# Altium schematic sheet Modem-GPRS.SchDoc
size Letter; ApprovedBy: M. en C. Fernando Bolaños; CheckedBy: M. en C. José Alberto Balderas Castillo (CID); Author: M. en C. José Alberto Balderas Castillo (CID); Revision: v1; NombreTarjeta: TELCOMGPRS-v1; NumeroDeHoja: 5 de 7; NombreBloque: Puertos Seriales RS232 Externos; FechaDiseno: 02-Junio-2015; FechaRevision: 05-Junio-2015; FechaAprobacion: 16-Junio-2015; TamanoHoja: Carta; NombreProyecto: Telemetria GPRS de Bajo Consumo de Energia
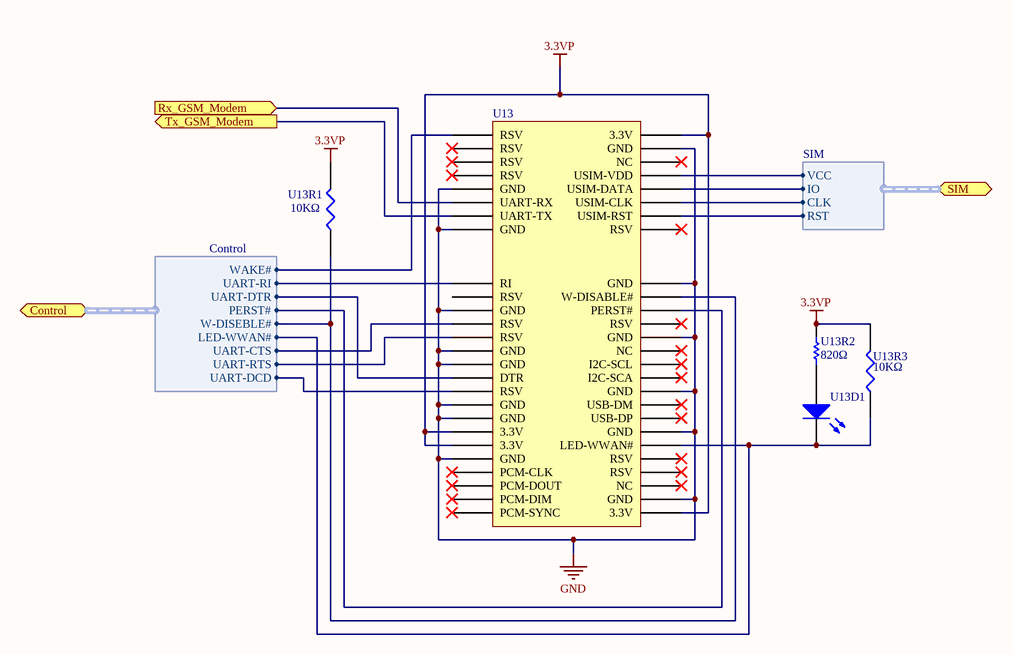
[diagram p0: Modem-GPRS.SchDoc]

## Parts
U13  MiniPCIe  [MiniPCI-52]  (value not drawn)
U13D1  LED2  [0805-LEDG]  (value not drawn)
U13R1  10KΩ  [0805-RES]
U13R2  820Ω  [0805-RES]
U13R3  10KΩ  [0805-RES]

## Ports
Control (harness Control), Rx_GSM_Modem (in), SIM (harness SIM), Tx_GSM_Modem (out)

## Harnesses
Control: UART-RI, UART-DTR, PERST#, W-DISEBLE#, LED-WWAN#, UART-CTS, UART-RTS, UART-DCD, WAKE#
SIM: VCC, IO, CLK, RST

## Nets
3.3VP: U13.2(3.3V) U13.39(3.3V) U13.41(3.3V) U13.52(3.3V) U13R1.2 U13R2.2 U13R3.2
GND: U13.4(GND) U13.9(GND) U13.15(GND) U13.18(GND) U13.21(GND) U13.26(GND) U13.27(GND) U13.29(GND) U13.34(GND) U13.35(GND) U13.37(GND) U13.40(GND) U13.43(GND) U13.50(GND)
Rx_GSM_Modem: U13.11(UART-RX) ; port Rx_GSM_Modem
Tx_GSM_Modem: U13.13(UART-TX) ; port Tx_GSM_Modem
NetU13_1: U13.1(RSV) ; port Control.WAKE#
NetU13_8: U13.8(USIM-VDD) ; port SIM.VCC
NetU13_10: U13.10(USIM-DATA) ; port SIM.IO
NetU13_12: U13.12(USIM-CLK) ; port SIM.CLK
NetU13_14: U13.14(USIM-RST) ; port SIM.RST
NetU13_17: U13.17(RI) ; port Control.UART-RI
NetU13_20: U13.20(W-DISABLE#) U13R1.1 ; port Control.W-DISEBLE#
NetU13_22: U13.22(PERST#) ; port Control.PERST#
NetU13_23: U13.23(RSV) ; port Control.UART-CTS
NetU13_25: U13.25(RSV) ; port Control.UART-RTS
NetU13_31: U13.31(DTR) ; port Control.UART-DTR
NetU13_33: U13.33(RSV) ; port Control.UART-DCD
NetU13_42: U13.42(LED-WWAN#) U13D1.2(K) U13R3.1 ; port Control.LED-WWAN#
NetU13D1_1: U13D1.1(A) U13R2.1

Not connected (* = marked no-connect by the designer): U13 3(RSV)* 5(RSV)* 6(NC)* 7(RSV)* 16(RSV)* 19(RSV) 24(RSV)* 28(NC)* 30(I2C-SCL)* 32(I2C-SCA)* 36(USB-DM)* 38(USB-DP)* 44(RSV)* 45(PCM-CLK)* 46(RSV)* 47(PCM-DOUT)* 48(NC)* 49(PCM-DIM)* 51(PCM-SYNC)*

## Notes on the sheet
- Elaboró
- Fecha
- Nombre del artículo
- Revisó
- Aprobó
- Número de parte
- Revisión
- Escala
- N/A
- Sección afectada
- Descripción del cambio
- Lámina
- 1/1
- Tolerancias
- Ruta del archivo

## Library data of the parts
U13 = PCIM: Mini PCIe; Manufacturer: TE Connectivity AMP Connectors; Manufacturer Part Number: 2041119-1; Supplier 1: Digi-Key; Supplier Part Number 1: A108265CT-ND
U13D1 = LED2: WL-SMCW SMD mono-color chip LED waterclear 0805 Green; Manufacturer: WURTH ELEKTRONIK; Manufacturer Part Number: 150080GS75000; Supplier 2: Digi-Key; Supplier Part Number 2: 732-4983-1-ND; Supplier 3: Newark; Supplier Part Number 3: 95W3800; Supplier 1: Wurth Elektronik; Supplier Part Number 1: 150080GS75000
U13R1 U13R3 = RES1: 10 kOhms ±5% 0.125W, 1/8W Chip Resistor 0805; Manufacturer Part Number: RC0805JR-0710KL; Manufacturer: Yageo; Value: 10KΩ; Supplier 1: Digi-Key; Supplier Part Number 1: 311-10KARCT-ND
U13R2 = Res1: PANASONIC ELECTRONIC COMPONENTS  ERJ-6GEYJ821V  Resistencia SMD Chip, Película Gruesa, 820 ohm, 150 V, 0805 [2012 Metric], 125 mW, ± 5%; Value: 820Ω; Supplier 2: Newark; Supplier Part Number 2: 65T8844; Manufacturer: PANASONIC ELECTRONIC COMPONENTS; Manufacturer Part Number: ERJ-6GEYJ821V; Supplier 1: Digi-Key; Supplier Part Number 1: P820ACT-ND